# Altium schematic sheet BLDC-FTDI.SchDoc
size 420 x 297 mm; ApprovedBy: Чистов; CheckedBy: Карасюк; DrawnBy: Войтенко; DocumentNumber: 321-720900.300 Э3; SheetNumber: 1; SheetTotal: 3; PageSetup: Record=PageOptions|CenterHorizontal=False|CenterVertical=False|PrintScale=0.95|XCorrection=0.00|YCorrection=0.00|PrintKind=1|BorderSize=5000000|LeftOffset=0|BottomOffset=0|Orientation=1|PaperLength=1000|PaperWidth=1000|Scale=100|PaperSource=15|PrintQuality=600|MediaType=1|DitherType=10|PaperKind=A4|PrintScaleMode=1; Letter1Column: Т; ProcessInspection: .; EngineerName: Чирун; NormInspection: Кузьма; DocumentType: Схема электрическая принципиальная; Developer1size1str: НТПЦ "Белкоммунмаш"; Title1size1str: Плата переферии
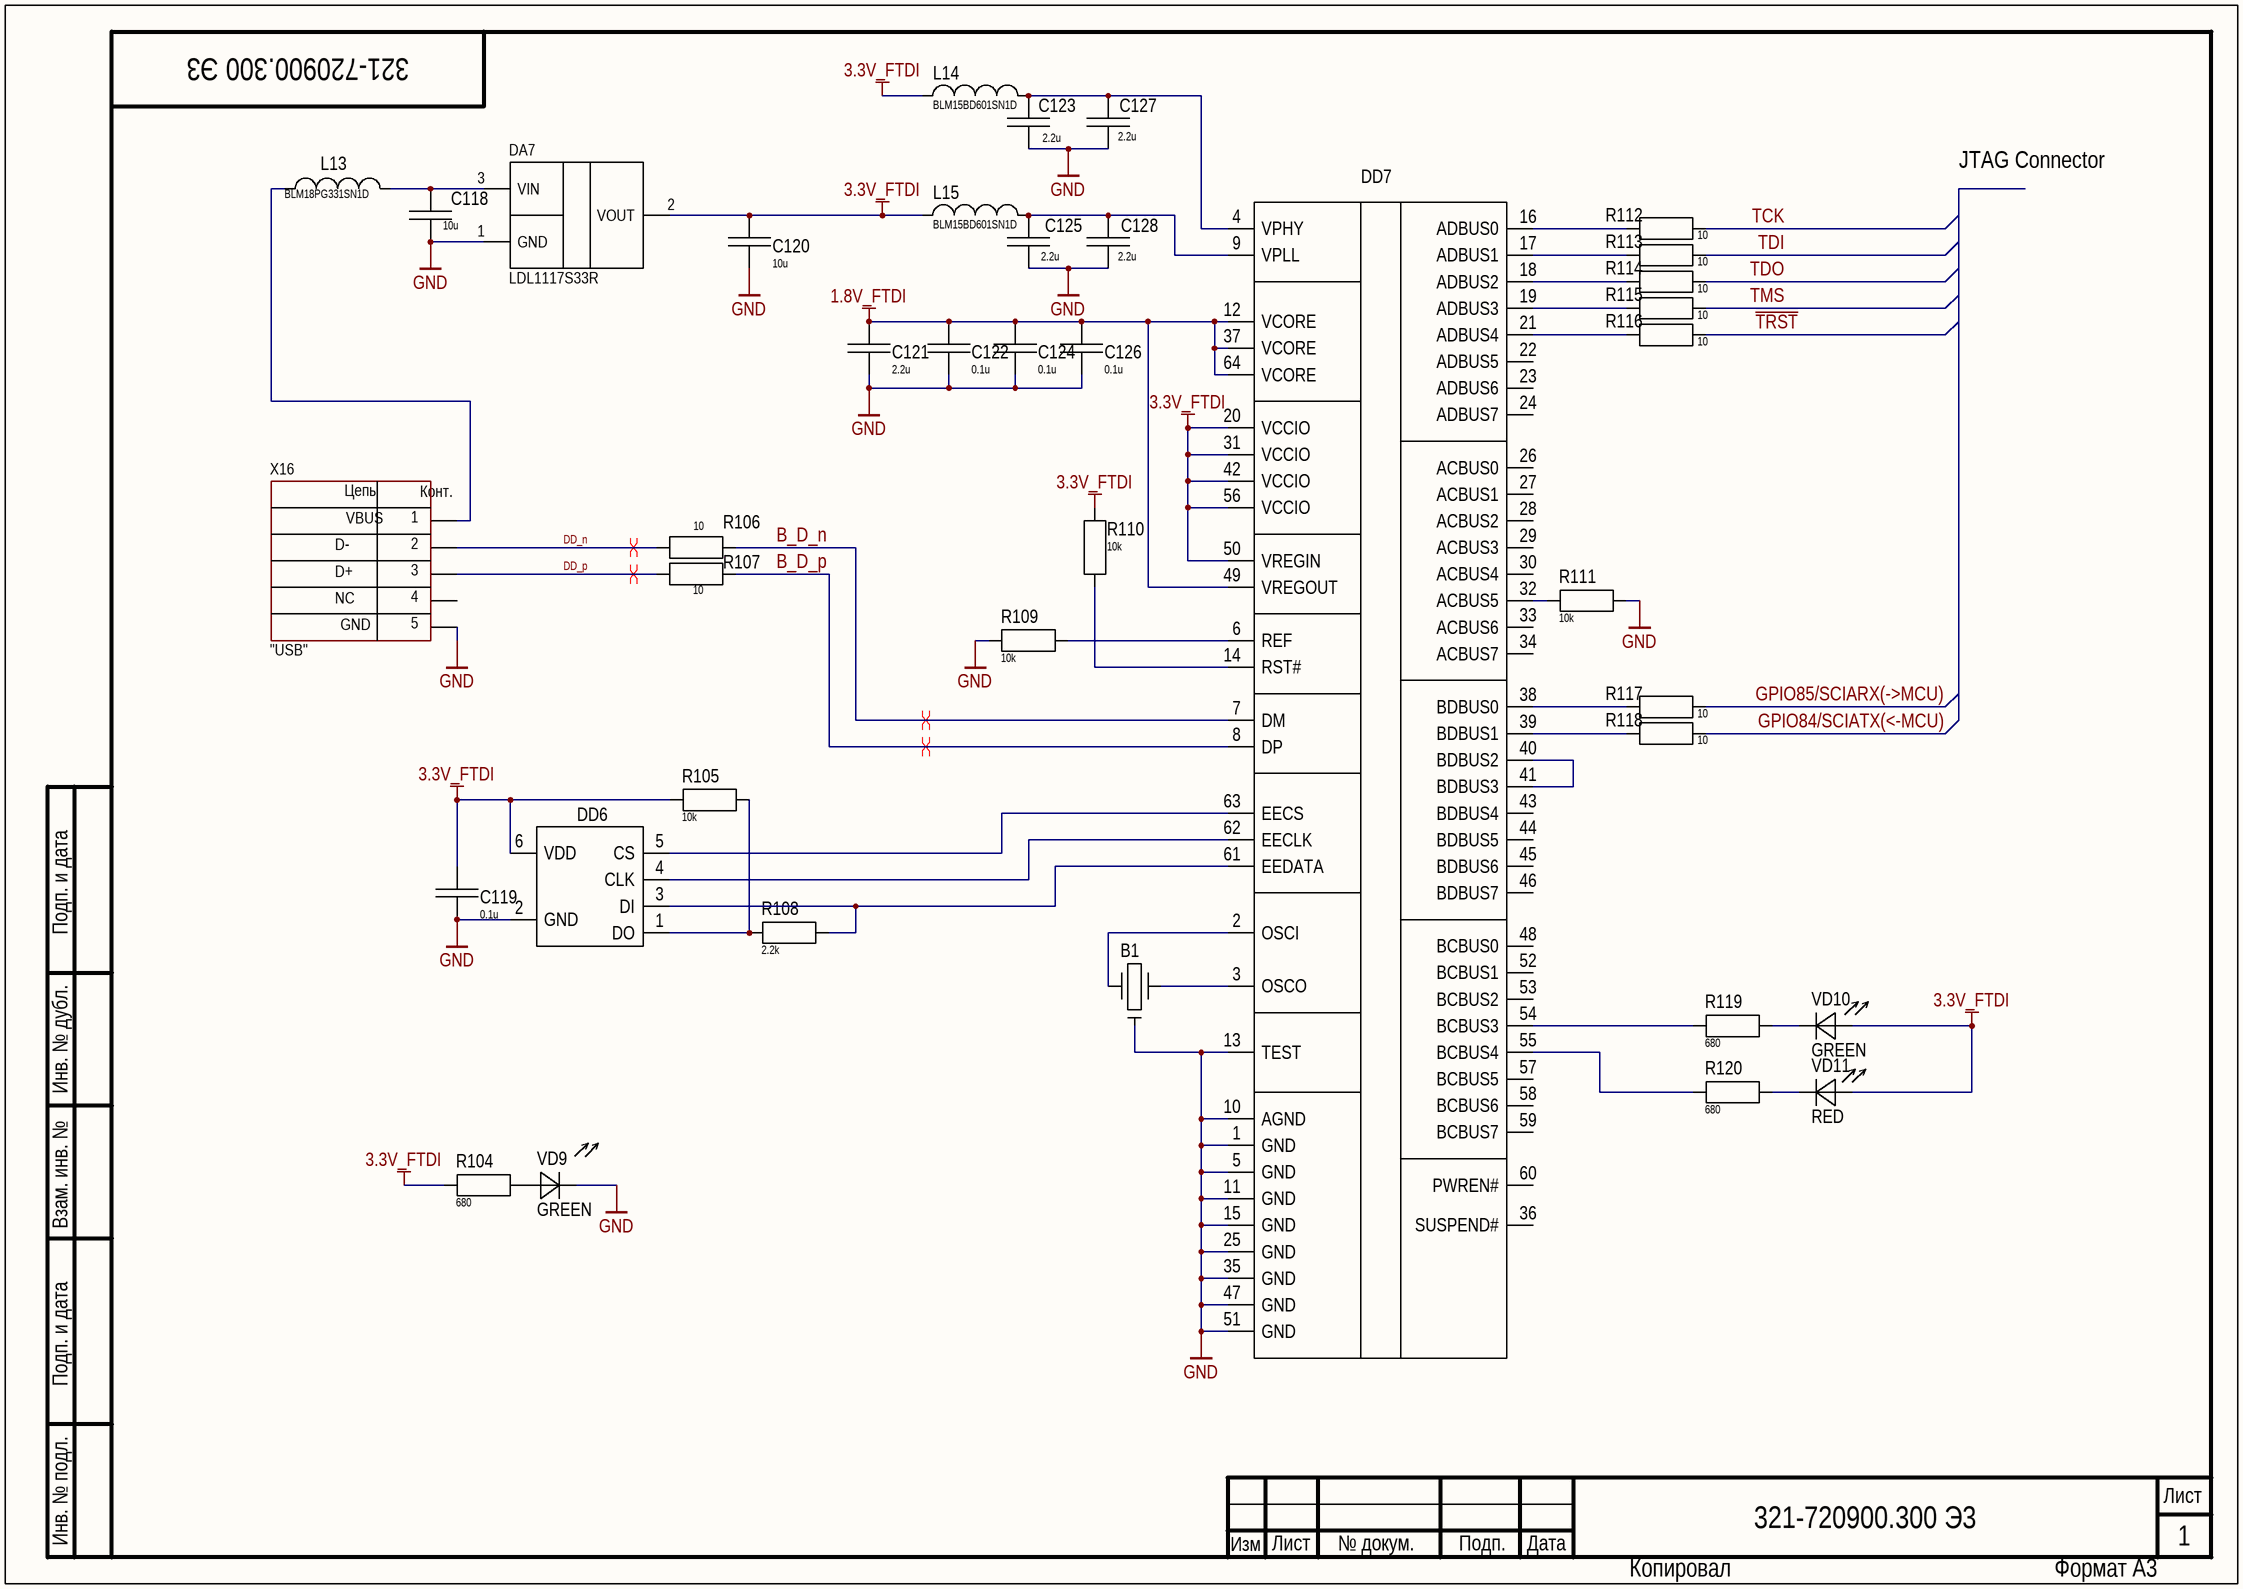
[diagram p0: BLDC-FTDI.SchDoc]

## Parts
B1  CSTCE12M0G52-R0  [OSC: CSTCE]  (value not drawn)
C118  10u  [CAP: 0805]
C119  0.1u  [CAP: 0402]
C120  10u  [CAP: 0805]
C121  2.2u  [CAP: 0402]
C122  0.1u  [CAP: 0402]
C123  2.2u  [CAP: 0402]
C124  0.1u  [CAP: 0402]
C125  2.2u  [CAP: 0402]
C126  0.1u  [CAP: 0402]
C127  2.2u  [CAP: 0402]
C128  2.2u  [CAP: 0402]
DA7  (no value)  [SOT223]
DD6  93LC56BT-I/OT  [SOT23-6]  (value not drawn)
DD7  FT2232HL  [64-LQFP]  (value not drawn)
L13  BLM18PG331SN1D  [IND: 0603]
L14  BLM15BD601SN1D  [IND: 0402]
L15  BLM15BD601SN1D  [IND: 0402]
R104  680  [RES: 0402]
R105  10k  [RES: 0402]
R106  10  [RES: 0402]
R107  10  [RES: 0402]
R108  2.2k  [RES: 0402]
R109  10k  [RES: 0402]
R110  10k  [RES: 0402]
R111  10k  [RES: 0402]
R112  10  [RES: 0402]
R113  10  [RES: 0402]
R114  10  [RES: 0402]
R115  10  [RES: 0402]
R116  10  [RES: 0402]
R117  10  [RES: 0402]
R118  10  [RES: 0402]
R119  680  [RES: 0402]
R120  680  [RES: 0402]
VD9  value GREEN  [LED: 0402G]  (hidden comment: Led 0402 GREEN)
VD10  value GREEN  [LED: 0402G]  (hidden comment: Led 0402 GREEN)
VD11  value RED  [LED: 0402R]  (hidden comment: Led 0402 RED)
X16  CommentText: "USB"  [CON: 0675031020]

## Nets
1.8V_FTDI: C121.2 C122.2 C124.2 C126.2 DD7.12(VCORE) DD7.37(VCORE) DD7.49(VREGOUT) DD7.64(VCORE)
3.3V_FTDI: C119.2 C120.2 DA7.2(VOUT) DD6.6(VDD) DD7.20(VCCIO) DD7.31(VCCIO) DD7.42(VCCIO) DD7.50(VREGIN) DD7.56(VCCIO) L14.1 L15.1 R104.2 R105.2 R110.1 VD10.1 VD11.1
GND: B1.2 C118.1 C119.1 C120.1 C121.1 C122.1 C123.1 C124.1 C125.1 C126.1 C127.1 C128.1 DA7.1(GND) DD6.2(GND) DD7.1(GND) DD7.5(GND) DD7.10(AGND) DD7.11(GND) DD7.13(TEST) DD7.15(GND) DD7.25(GND) DD7.35(GND) DD7.47(GND) DD7.51(GND) R109.2 R111.2 VD9.2 X16.5
B_D_n: DD7.7(DM) R106.1
B_D_p: DD7.8(DP) R107.1
DD_n: R106.2 X16.2
DD_p: R107.2 X16.3
GPIO84/SCIATX(<-MCU): R118.1
GPIO85/SCIARX(->MCU): R117.1
~{TRST}: R116.1
TCK: R112.1
TDI: R113.1
TDO: R114.1
TMS: R115.1
NetB1_1: B1.1 DD7.2(OSCI)
NetB1_3: B1.3 DD7.3(OSCO)
NetC118_2: C118.2 DA7.3(VIN) L13.1
NetC123_2: C123.2 C127.2 DD7.4(VPHY) L14.2
NetC125_2: C125.2 C128.2 DD7.9(VPLL) L15.2
NetDD6_1: DD6.1(DO) R105.1 R108.2
NetDD6_3: DD6.3(DI) DD7.61(EEDATA) R108.1
NetDD6_4: DD6.4(CLK) DD7.62(EECLK)
NetDD6_5: DD6.5(CS) DD7.63(EECS)
NetDD7_6: DD7.6(REF) R109.1
NetDD7_14: DD7.14(RST#) R110.2
NetDD7_16: DD7.16(ADBUS0) R112.2
NetDD7_17: DD7.17(ADBUS1) R113.2
NetDD7_18: DD7.18(ADBUS2) R114.2
NetDD7_19: DD7.19(ADBUS3) R115.2
NetDD7_21: DD7.21(ADBUS4) R116.2
NetDD7_32: DD7.32(ACBUS5) R111.1
NetDD7_38: DD7.38(BDBUS0) R117.2
NetDD7_39: DD7.39(BDBUS1) R118.2
NetDD7_40: DD7.40(BDBUS2) DD7.41(BDBUS3)
NetDD7_54: DD7.54(BCBUS3) R119.1
NetDD7_55: DD7.55(BCBUS4) R120.1
NetL13_2: L13.2 X16.1
NetR104_1: R104.1 VD9.1
NetR119_2: R119.2 VD10.2
NetR120_2: R120.2 VD11.2

Not connected (* = marked no-connect by the designer): DD7 22(ADBUS5) 23(ADBUS6) 24(ADBUS7) 26(ACBUS0) 27(ACBUS1) 28(ACBUS2) 29(ACBUS3) 30(ACBUS4) 33(ACBUS6) 34(ACBUS7) 36(SUSPEND#) 43(BDBUS4) 44(BDBUS5) 45(BDBUS6) 46(BDBUS7) 48(BCBUS0) 52(BCBUS1) 53(BCBUS2) 57(BCBUS5) 58(BCBUS6) 59(BCBUS7) 60(PWREN#); X16 4

## Layout directives
differential pair: B_D_n, B_D_p, DD_n, DD_p

## Notes on the sheet
- JTAG Connector
- Подп. и дата
- Инв. № дубл.
- Взам. инв. №
- Инв. № подл.
- Лист
- Изм
- № докум.
- Подп.
- Дата
- Копировал
- Формат А3
- (in symbol Connector_USB_mini_B) Цепь; Конт.; VBUS; D-; D+; NC; GND

## Library data of the parts
B1 = CSTCE12M0G52-R0: Value: 12MHz; Type: Crystal Clock; PartNumber: CSTCE12M0G52-R0
C118 C120 = CAP 0805: PartNumber: CC0402MRX5R5BB106; Voltage: 6.3V; Value: 10u
C119 C122 C124 C126 = CAP 0402: PartNumber: C0402C104K8PAC; Manufacturer: Kemet; Voltage: 10V; Type: Capacitor; Temperature_Range: -55/+85; Tolerance: 10%; Value: 0.1u; Case: 0402
C121 C123 C125 C127 C128 = CAP 0402: PartNumber: CC0402MRX5R5BB106; Voltage: 6.3V; Value: 2.2u
DA7 = LDL1117S33R: Linear voltage regulator; Manufacturer: STMicroelectronics; ValueManufacturerPartNumber: Linear voltage regulator, input 3.9...18V, 0.6V, output 3.3V, 1.2A, -40...+85°C, SOT223; VoltageInput: input 3.9...18V; MaxDropout: 0.6V; CurrentOutput: 1.2A; VoltageOutput: output 3.3V; HelpURL: https://www.digikey.com/product-detail/en/stmicroelectronics/LDL1117S33R/497-17239-1-ND/7102079; Package: SOT223; ComponentType: Linear voltage regulator; Temperature: -40...+85°C; PartNumber: LDL1117S33R
R104 R119 R120 = RES 0402: PartNumber: RC0402FR-07680RL; Value: 680; Case: 0402
R105 R109-R111 = RES 0402: PartNumber: RC0402FR-0710KL; Tolerance: 1%; Value: 10k; Manufacturer: *; Type: Resistor; Temperature_Range: *; Composition: *; Voltage: *; Case: 0402
R106 R107 R112-R118 = RES 0402: PartNumber: RC0402FR-0710RL; Tolerance: 1%; Value: 10; Manufacturer: *; Type: Resistor; Temperature_Range: *; Composition: *; Voltage: *; Case: 0402
R108 = RES 0402: PartNumber: RC0402FR-072K2L; Tolerance: 1%; Value: 2.2k; Manufacturer: *; Type: Resistor; Temperature_Range: *; Composition: *; Voltage: *; Case: 0402
VD9 VD10 = Led 0402 GREEN: PartNumber: SML-P11MTT86R; Case: 0402
VD11 = Led 0402 RED: PartNumber: SML-P11VTT86R; Case: 0402
X16 = Connector_USB_mini_B: Manufacturer: Molex; ValueManufacturerPartNumber: USB mini B; PartNumber: 0675031020; HelpURL: https://www.digikey.com/product-detail/en/molex/0675031020/WM5461CT-ND/1624427; TypeConnector: USB mini B
DD6 = 93LC56BT-I/OT: PartNumber: 93LC56BT-I/OT
DD7 = FT2232HL: PartNumber: FT2232HL
L13 = BLM18PG331SN1D: PartNumber: BLM18PG331SN1D
L14 L15 = BLM15BD601SN1D: PartNumber: BLM15BD601SN1D